# Altium schematic sheet DB10005_CAN.SchDoc: CAN interface
size A4; SheetNumber: 6; SheetTotal: 7
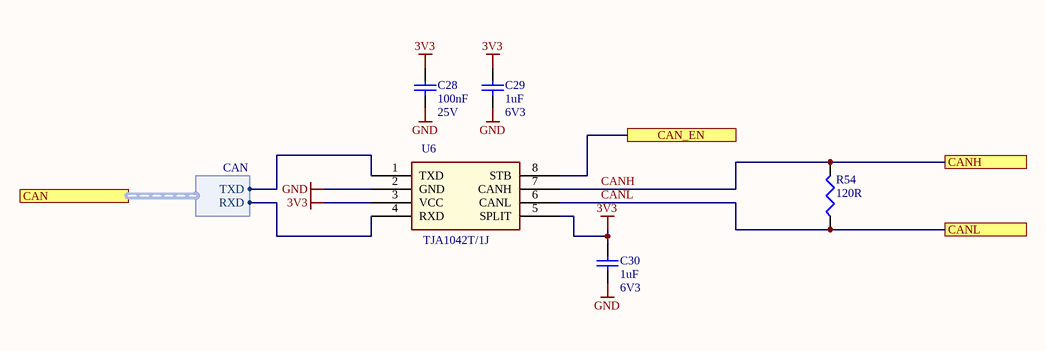
[diagram p0: DB10005_CAN.SchDoc]

## Parts
C28  100nF  Voltage Rating: 25V  [C0402]
C29  1uF  Voltage Rating: 6V3  [C0402]
C30  1uF  Voltage Rating: 6V3  [C0402]
R54  120R  [0805]
U6  TJA1042T/1J  [SOP-8]

## Ports
CAN (harness CAN), CAN_EN, CANH, CANL

## Harnesses
CAN: RXD, TXD

## Nets
3V3: C28.2 C29.2 C30.2 U6.3(VCC) U6.5(SPLIT)
GND: C28.1 C29.1 C30.1 U6.2(GND)
CAN_EN: U6.8(STB) ; port CAN_EN
CANH: R54.2 U6.7(CANH) ; port CANH
CANL: R54.1 U6.6(CANL) ; port CANL
NetU6_1: U6.1(TXD) ; port CAN.TXD
NetU6_4: U6.4(RXD) ; port CAN.RXD

## Notes on the sheet
- Title
- Size:
- Date:
- A4
- Number:
- Time:
- Revision:
- Sheet
- of
- File:

## Library data of the parts
C28 = 100nF/0402/CER/25V: Capacitor, 100nF, 25V, X7R; Capacitance Tolerance: 10nF; Capacitor Case Style: 0402; Brand Number: GRM155R71E104KE14D; Brand: MULTICOMP; Dielectric Characteristic: X7R; Capacitance: 100nF; Temperature Range: -55 to +125 C; Price: 0,0225; Order Code Supplier: 2456106; Supplier: Farnell
C29 C30 = 1uF/0402/CER/6.3V: Capacitor, 1uF, 6.3V, X5R; Capacitance Tolerance: ± 10%; Capacitor Case Style: 0402; Brand Number: 04026D105KAT2A; Brand: AVX; Dielectric Characteristic: X5R; Capacitance: 1uF; Temperature Range: -55°C to +85°C; Price: 0,0874; Order Code Supplier: 1327658; Supplier: Farnell
R54 = 0/0805/0100W/150V: Resistor, 0R, 0.1%, 0.1W, 150V, 200PPM, 0805; Brand: MULTICOMP; Brand Number: MC 0.1W 0805 0R; Case Style: 0805; Order Code Supplier: 9333681; Power Rating: 0.1W; Price: 0,038; Resistance: 0R; Supplier: Farnell; Temperature Coefficient: ± 200PPM; Temperature Range: -55°C to +125°C; Voltage Rating: 150V